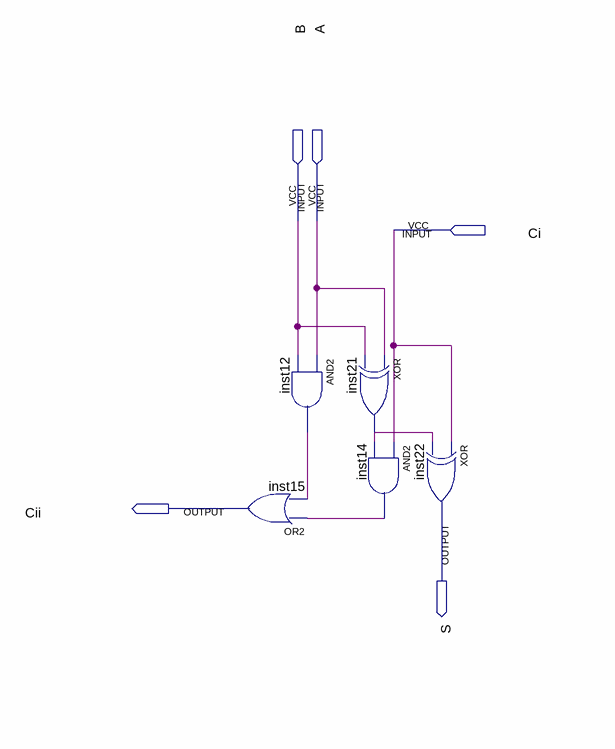
[diagram p0: schematic sheet]
// Quartus schematic Block2.bdf as structural Verilog: 5 symbols, 5 pins
module Block2 (
  input  B,
  input  A,
  input  Ci,
  output Cii,
  output S
);

  wire inst12_out, inst14_out, inst21_out;

  or inst15 (Cii, inst14_out, inst12_out);
  and inst12 (inst12_out, A, B);
  xor inst21 (inst21_out, A, B);
  and inst14 (inst14_out, Ci, inst21_out);
  xor inst22 (S, Ci, inst21_out);
endmodule
